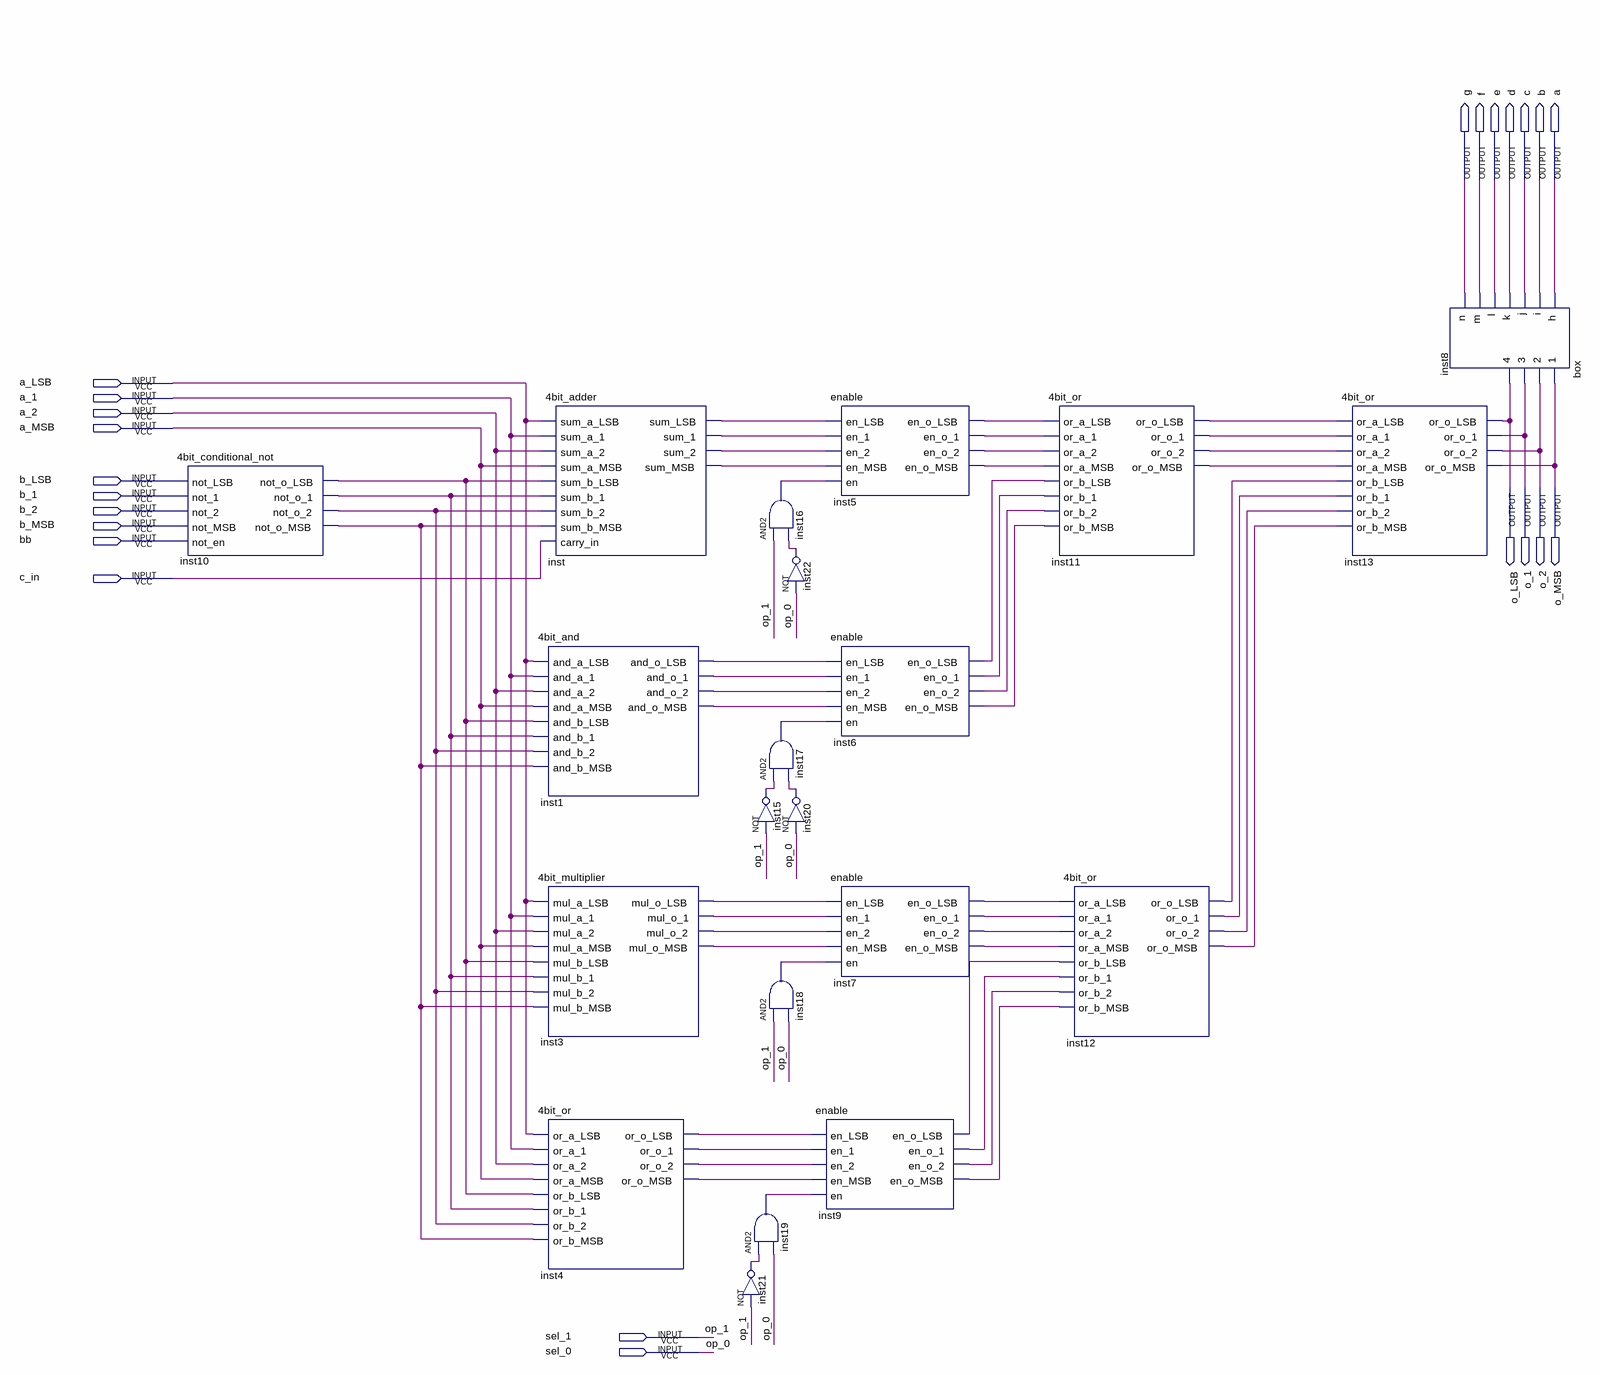
[diagram p0: schematic sheet]
// Quartus schematic bcd.bdf as structural Verilog: 21 symbols, 23 pins
module bcd (
  input  a_LSB,
  input  a_1,
  input  a_2,
  input  a_MSB,
  input  b_LSB,
  input  b_1,
  input  b_2,
  input  b_MSB,
  input  bb,
  input  c_in,
  input  sel_1,
  input  sel_0,
  output g,
  output f,
  output e,
  output d,
  output c,
  output b,
  output a,
  output o_LSB,
  output o_1,
  output o_2,
  output o_MSB
);

  wire inst1_and_o_1, inst1_and_o_2, inst1_and_o_lsb, inst1_and_o_msb, inst3_mul_o_1, inst3_mul_o_2,
       inst3_mul_o_lsb, inst3_mul_o_msb, inst4_or_o_1, inst4_or_o_2, inst4_or_o_lsb, inst4_or_o_msb,
       inst5_en_o_1, inst5_en_o_2, inst5_en_o_lsb, inst5_en_o_msb, inst6_en_o_1, inst6_en_o_2,
       inst6_en_o_lsb, inst6_en_o_msb, inst7_en_o_1, inst7_en_o_2, inst7_en_o_lsb, inst7_en_o_msb,
       inst9_en_o_1, inst9_en_o_2, inst9_en_o_lsb, inst9_en_o_msb, inst10_not_o_1, inst10_not_o_2,
       inst10_not_o_lsb, inst10_not_o_msb, inst11_or_o_1, inst11_or_o_2, inst11_or_o_lsb, inst11_or_o_msb,
       inst12_or_o_1, inst12_or_o_2, inst12_or_o_lsb, inst12_or_o_msb, inst15_out, inst16_out, inst17_out,
       inst18_out, inst19_out, inst20_out, inst21_out, inst22_out, inst_sum_1, inst_sum_2, inst_sum_lsb,
       inst_sum_msb;

  \4bit_conditional_not  inst10 (
    .not_LSB(b_LSB), .not_1(b_1), .not_2(b_2), .not_MSB(b_MSB), .not_en(bb), .not_o_LSB(inst10_not_o_lsb),
    .not_o_1(inst10_not_o_1), .not_o_2(inst10_not_o_2), .not_o_MSB(inst10_not_o_msb));
  \4bit_adder  inst (
    .sum_a_LSB(a_LSB), .sum_a_1(a_1), .sum_a_2(a_2), .sum_a_MSB(a_MSB), .sum_b_LSB(inst10_not_o_lsb),
    .sum_b_1(inst10_not_o_1), .sum_b_2(inst10_not_o_2), .sum_b_MSB(inst10_not_o_msb), .carry_in(c_in),
    .sum_LSB(inst_sum_lsb), .sum_1(inst_sum_1), .sum_2(inst_sum_2), .sum_MSB(inst_sum_msb));
  \4bit_and  inst1 (
    .and_a_LSB(a_LSB), .and_a_1(a_1), .and_a_2(a_2), .and_a_MSB(a_MSB), .and_b_LSB(inst10_not_o_lsb),
    .and_b_1(inst10_not_o_1), .and_b_2(inst10_not_o_2), .and_b_MSB(inst10_not_o_msb),
    .and_o_LSB(inst1_and_o_lsb), .and_o_1(inst1_and_o_1), .and_o_2(inst1_and_o_2), .and_o_MSB(inst1_and_o_msb));
  \4bit_multiplier  inst3 (
    .mul_a_LSB(a_LSB), .mul_a_1(a_1), .mul_a_2(a_2), .mul_a_MSB(a_MSB), .mul_b_LSB(inst10_not_o_lsb),
    .mul_b_1(inst10_not_o_1), .mul_b_2(inst10_not_o_2), .mul_b_MSB(inst10_not_o_msb),
    .mul_o_LSB(inst3_mul_o_lsb), .mul_o_1(inst3_mul_o_1), .mul_o_2(inst3_mul_o_2), .mul_o_MSB(inst3_mul_o_msb));
  \4bit_or  inst4 (
    .or_a_LSB(a_LSB), .or_a_1(a_1), .or_a_2(a_2), .or_a_MSB(a_MSB), .or_b_LSB(inst10_not_o_lsb),
    .or_b_1(inst10_not_o_1), .or_b_2(inst10_not_o_2), .or_b_MSB(inst10_not_o_msb), .or_o_LSB(inst4_or_o_lsb),
    .or_o_1(inst4_or_o_1), .or_o_2(inst4_or_o_2), .or_o_MSB(inst4_or_o_msb));
  and inst16 (inst16_out, sel_1, inst22_out);
  and inst17 (inst17_out, inst15_out, inst20_out);
  not inst15 (inst15_out, sel_1);
  and inst18 (inst18_out, sel_1, sel_0);
  and inst19 (inst19_out, inst21_out, sel_0);
  not inst21 (inst21_out, sel_1);
  not inst22 (inst22_out, sel_0);
  not inst20 (inst20_out, sel_0);
  enable inst9 (
    .en_LSB(inst4_or_o_lsb), .en_1(inst4_or_o_1), .en_2(inst4_or_o_2), .en_MSB(inst4_or_o_msb),
    .en(inst19_out), .en_o_LSB(inst9_en_o_lsb), .en_o_1(inst9_en_o_1), .en_o_2(inst9_en_o_2),
    .en_o_MSB(inst9_en_o_msb));
  enable inst5 (
    .en_LSB(inst_sum_lsb), .en_1(inst_sum_1), .en_2(inst_sum_2), .en_MSB(inst_sum_msb), .en(inst16_out),
    .en_o_LSB(inst5_en_o_lsb), .en_o_1(inst5_en_o_1), .en_o_2(inst5_en_o_2), .en_o_MSB(inst5_en_o_msb));
  enable inst6 (
    .en_LSB(inst1_and_o_lsb), .en_1(inst1_and_o_1), .en_2(inst1_and_o_2), .en_MSB(inst1_and_o_msb),
    .en(inst17_out), .en_o_LSB(inst6_en_o_lsb), .en_o_1(inst6_en_o_1), .en_o_2(inst6_en_o_2),
    .en_o_MSB(inst6_en_o_msb));
  enable inst7 (
    .en_LSB(inst3_mul_o_lsb), .en_1(inst3_mul_o_1), .en_2(inst3_mul_o_2), .en_MSB(inst3_mul_o_msb),
    .en(inst18_out), .en_o_LSB(inst7_en_o_lsb), .en_o_1(inst7_en_o_1), .en_o_2(inst7_en_o_2),
    .en_o_MSB(inst7_en_o_msb));
  \4bit_or  inst11 (
    .or_a_LSB(inst5_en_o_lsb), .or_a_1(inst5_en_o_1), .or_a_2(inst5_en_o_2), .or_a_MSB(inst5_en_o_msb),
    .or_b_LSB(inst6_en_o_lsb), .or_b_1(inst6_en_o_1), .or_b_2(inst6_en_o_2), .or_b_MSB(inst6_en_o_msb),
    .or_o_LSB(inst11_or_o_lsb), .or_o_1(inst11_or_o_1), .or_o_2(inst11_or_o_2), .or_o_MSB(inst11_or_o_msb));
  \4bit_or  inst12 (
    .or_a_LSB(inst7_en_o_lsb), .or_a_1(inst7_en_o_1), .or_a_2(inst7_en_o_2), .or_a_MSB(inst7_en_o_msb),
    .or_b_LSB(inst9_en_o_lsb), .or_b_1(inst9_en_o_1), .or_b_2(inst9_en_o_2), .or_b_MSB(inst9_en_o_msb),
    .or_o_LSB(inst12_or_o_lsb), .or_o_1(inst12_or_o_1), .or_o_2(inst12_or_o_2), .or_o_MSB(inst12_or_o_msb));
  \4bit_or  inst13 (
    .or_a_LSB(inst11_or_o_lsb), .or_a_1(inst11_or_o_1), .or_a_2(inst11_or_o_2), .or_a_MSB(inst11_or_o_msb),
    .or_b_LSB(inst12_or_o_lsb), .or_b_1(inst12_or_o_1), .or_b_2(inst12_or_o_2), .or_b_MSB(inst12_or_o_msb),
    .or_o_LSB(o_LSB), .or_o_1(o_1), .or_o_2(o_2), .or_o_MSB(o_MSB));
  box inst8 (.\1 (o_MSB), .\2 (o_2), .\3 (o_1), .\4 (o_LSB), .h(a), .i(b), .j(c), .k(d), .l(e), .m(f), .n(g));

  // Other names for the same wires on the sheet: op_0 = sel_0; op_1 = sel_1
endmodule
